# EAGLE design POE_PD_1_P-Schalter (EAGLE 6.5.0)
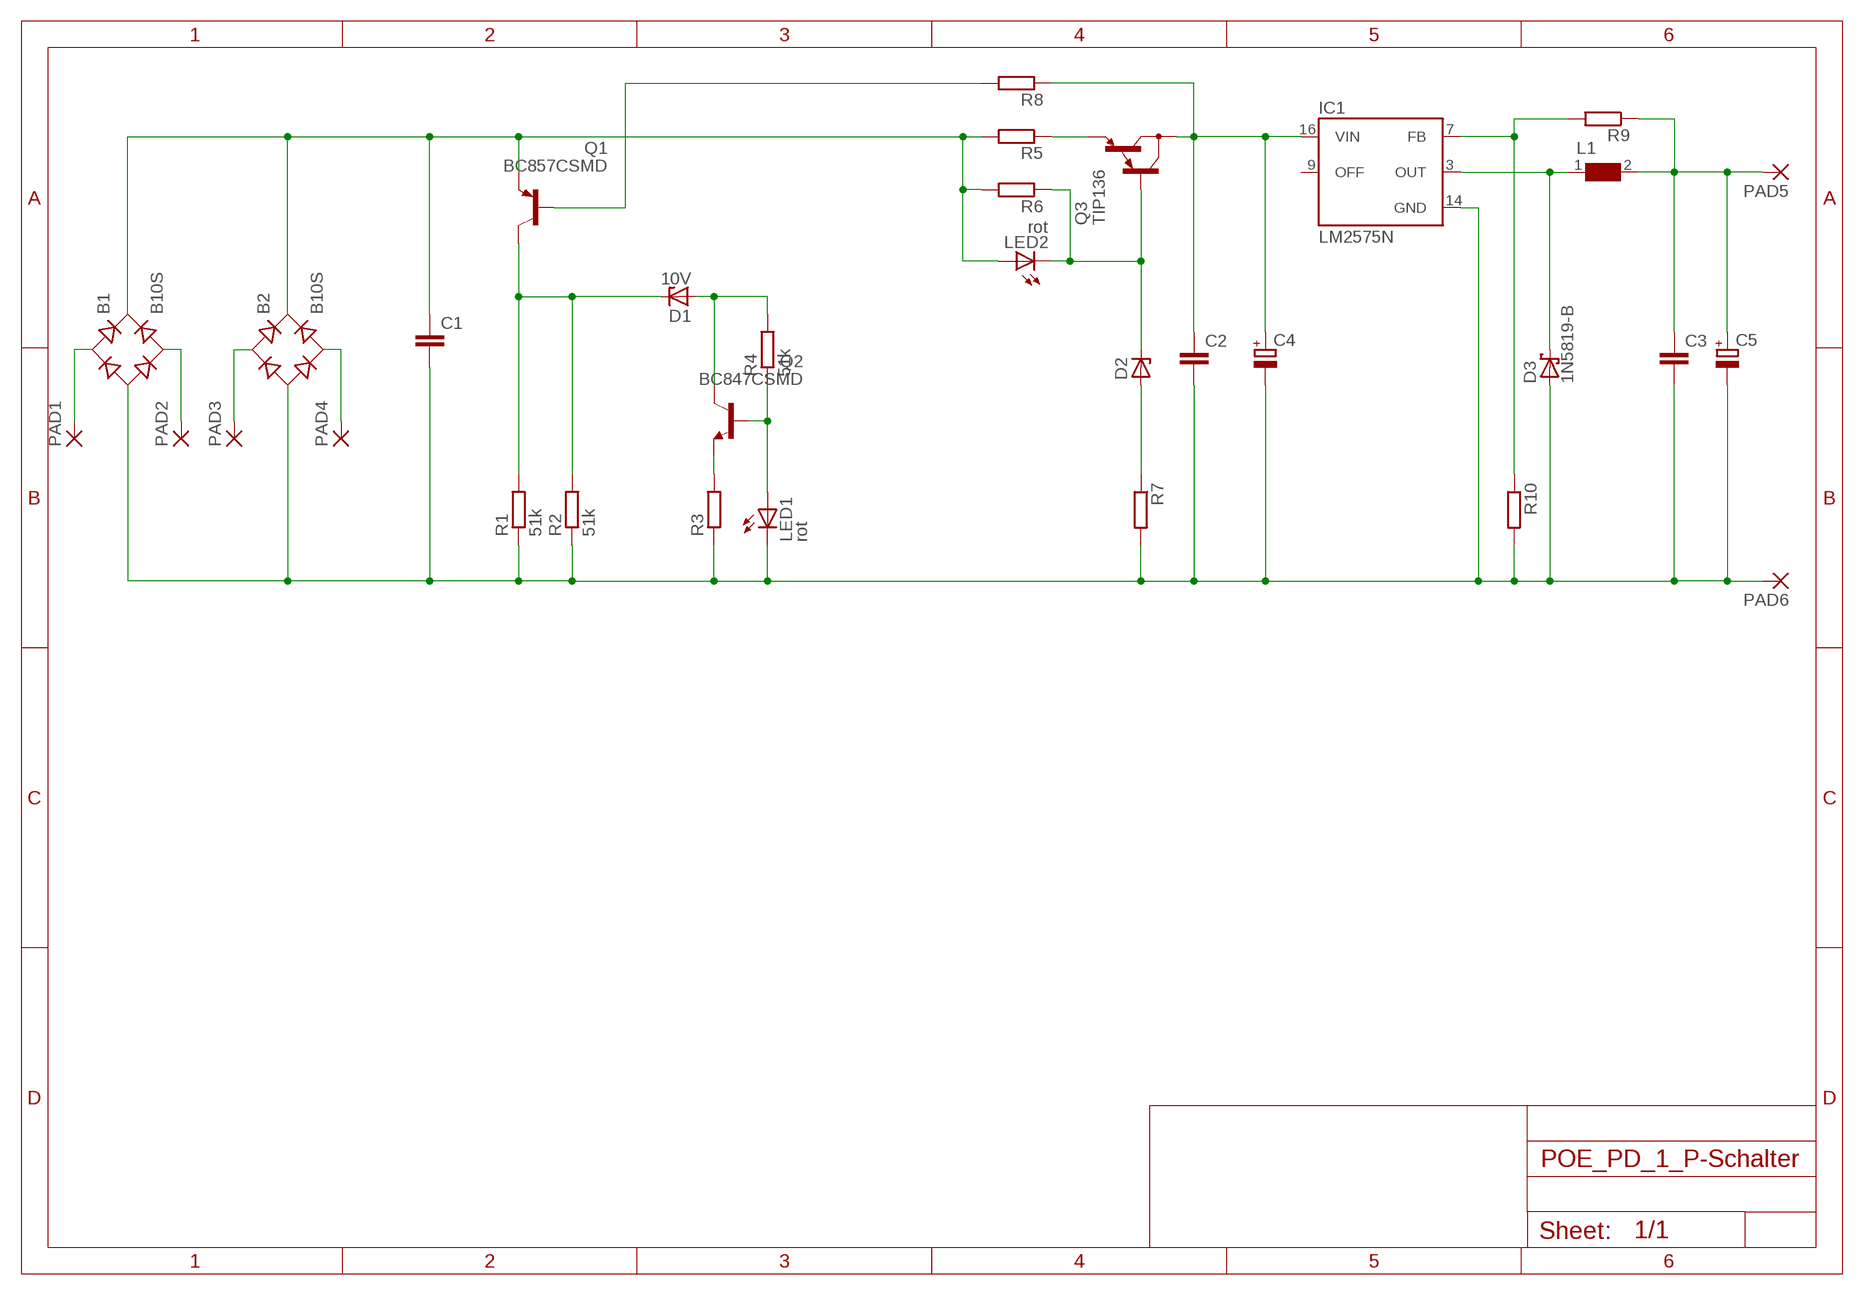
[diagram p0: schematic, sheet 1]

## Parts
B1  B10S  [MBS]
B2  B10S  [MBS]
C1  C-EUC0805  [C0805]
C2  C-EUC0805  [C0805]
C3  C-EUC0805  [C0805]
C4  CPOL-EU153CLV-0807  [153CLV-0807]
C5  CPOL-EU153CLV-0807  [153CLV-0807]
D1  10V  ZENER-DIODESOT23  [SOT23]
D2  ZENER-DIODESOT23  [SOT23]
D3  1N5819-B  [DO41-7.6]
IC1  LM2575N  [DIL16]
L1  WE-PD2_S  [WE-PD2_S]
LED1  rot  LEDCHIP-LED0805  [CHIP-LED0805]
LED2  rot  LEDCHIP-LED0805  [CHIP-LED0805]
PAD1  2,15/1,0  [2,15/1,0]
PAD2  2,15/1,0  [2,15/1,0]
PAD3  2,15/1,0  [2,15/1,0]
PAD4  2,15/1,0  [2,15/1,0]
PAD5  2,15/1,0  [2,15/1,0]
PAD6  2,15/1,0  [2,15/1,0]
Q1  BC857CSMD  [SOT23-BEC]
Q2  BC847CSMD  [SOT23]
Q3  TIP136  [TO220]
R1  51k  R-EU_R0603  [R0603]
R2  51k  R-EU_R0603  [R0603]
R3  R-EU_R0603  [R0603]
R4  51k  R-EU_R0603  [R0603]
R5  R-EU_R0603  [R0603]
R6  R-EU_R0603  [R0603]
R7  R-EU_R0603  [R0603]
R8  R-EU_R0603  [R0603]
R9  R-EU_R0603  [R0603]
R10  R-EU_R0603  [R0603]

## Nets
N$1: B1.- B2.- C1.2 C2.2 C3.2 C4.- C5.- D3.A IC1.14(GND) LED1.C PAD6.1(P) R1.1 R2.1 R3.1 R7.2 R10.2
N$2: B1.+ B2.+ C1.1 LED2.A Q1.E R5.2 R6.2
N$3: D1.3(C) Q1.C R1.2 R2.2
N$4: LED1.A Q2.1(B) R4.1
N$5: B1.AC1 PAD1.1(P)
N$6: Q2.2(E) R3.2
N$7: Q1.B R8.2
N$8: D1.1(A) Q2.3(C) R4.2
N$9: D2.1(A) R7.1
N$10: Q3.3(E) R5.1
N$11: D2.3(C) LED2.C Q3.1(B) R6.1
N$12: D3.C IC1.3(OUT) L1.1
N$13: C3.1 C5.+ L1.2 PAD5.1(P) R9.1
N$14: C2.1 C4.+ IC1.16(VIN) Q3.2(C) R8.1
N$15: IC1.7(FB) R9.2 R10.1
N$16: B1.AC2 PAD2.1(P)
N$17: B2.AC1 PAD3.1(P)
N$18: B2.AC2 PAD4.1(P)
Unconnected: IC1.9(OFF)

## Library data of the parts
B1 B2 = rectifier:B*S: Surface Mount Glass Passivated Bridge Rectifiers Source: Comchip Bridge Rectifiers B05S-G_B10S-G.pdf
C1-C3 = rcl:C-EU: CAPACITOR, European symbol
C4 C5 = rcl:CPOL-EU: POLARIZED CAPACITOR, European symbol
D1 D2 = diode:ZENER-DIODE: Z-Diode
D3 = diode:1N581*: 1.0A SCHOTTKY BARRIER RECTIFIER Source: http://www.diodes.com/datasheets/ds23001.pdf
IC1 = v-reg-3:LM2575: National Semiconductor <http://www.national.com> 1.0A "Simple Switcher"(c) 52kHz, Vout 1.23-37V (HV: 57V), Vin 40V (HV: 60V), 50µA standby current
L1 = wuerth_elektronik_EAGLE:WE-PD2: SMD-Power Inductors WE-PD2 Is recommended for the application with switching regulators from National Semiconductor, Linear Technology, Texas Instruments and Fairchild Semiconductor -- Switching regulators with low operating voltages (computer, laptop, mobile phones, pagers) -- Integrated DC/DC-converter
LED1 LED2 = led:LED: LED OSRAM: - CHIPLED LG R971, LG N971, LY N971, LG Q971, LY Q971, LO R971, LY R971 LH N974, LH R974 LS Q976, LO Q976, LY Q976 LO Q996 - Hyper CHIPLED LW Q18S LB Q993, LB Q99A, LB R99A - SideLED LS A670, LO A670, LY A670, LG A670, LP A670 LB A673, LV A673, LT A673, LW A673 LH A674 LY A675 LS A676, LA A676, LO A676, LY A676, LW A676 LS A679, LY A679, LG A679 - Hyper Micro SIDELED® LS Y876, LA Y876, LO Y876, LY Y876 LT Y87S - SmartLED LW L88C, LW L88S LB L89C, LB L89S, LG L890 LS L89K, LO L89K, LY L89K LS L896, LA L896, LO L896, LY L896 - TOPLED LS T670, LO T670, LY T670, LG T670, LP T670 LSG T670, LSP T670, LSY T670, LOP T670, LYG T670 LG T671, LOG T671, LSG T671 LB T673, LV T673, LT T673, LW T673 LH T674 LS T676, LA T676, LO T676, LY T676, LB T676, LH T676, LSB T676, LW T676 LB T67C, LV T67C, LT T67C, LS T67K, LO T67K, LY T67K, LW E67C LS E67B, LA E67B, LO E67B, LY E67B, LB E67C, LV E67C, LT E67C LW T67C LS T679, LY T679, LG T679 LS T770, LO T770, LY T770, LG T770, LP T770 LB T773, LV T773, LT T773, LW T773 LH T774 LS E675, LA E675, LY E675, LS T675 LS T776, LA T776, LO T776, LY T776, LB T776 LHGB T686 LT T68C, LB T68C - Hyper Mini TOPLED® LB M676 - Mini TOPLED Santana® LG M470 LS M47K, LO M47K, LY M47K Source: http://www.osram.convergy.de LUXEON: - LUMILED® LXK2-PW12-R00, LXK2-PW12-S00, LXK2-PW14-U00, LXK2-PW14-V00 LXK2-PM12-R00, LXK2-PM12-S00, LXK2-PM14-U00 LXK2-PE12-Q00, LXK2-PE12-R00, LXK2-PE12-S00, LXK2-PE14-T00, LXK2-PE14-U00 LXK2-PB12-K00, LXK2-PB12-L00, LXK2-PB12-M00, LXK2-PB14-N00, LXK2-PB14-P00, LXK2-PB14-Q00 LXK2-PR12-L00, LXK2-PR12-M00, LXK2-PR14-Q00, LXK2-PR14-R00 LXK2-PD12-Q00, LXK2-PD12-R00, LXK2-PD12-S00 LXK2-PH12-R00, LXK2-PH12-S00 LXK2-PL12-P00, LXK2-PL12-Q00, LXK2-PL12-R00 Source: www.luxeon.com KINGBRIGHT: KA-3528ASYC Source: www.kingbright.com
PAD1-PAD6 = wirepad:2,15/1,0: THROUGH-HOLE PAD
Q1 = transistor-pnp:BC857*: PNP Transistror
Q2 = transistor-npn:BC847*: NPN Transistor
Q3 = transistor-pnp:TIP136: PNP Darlington Transistor
R1-R10 = rcl:R-EU_: RESISTOR, European symbol

## Board
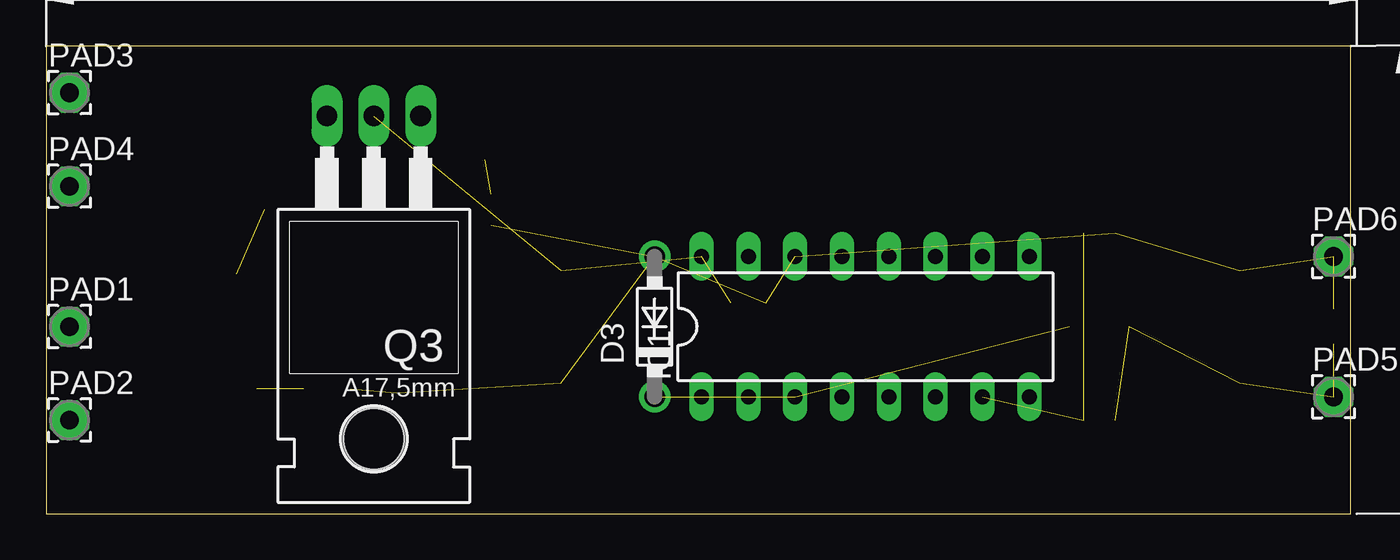
[diagram p1: board, top side]
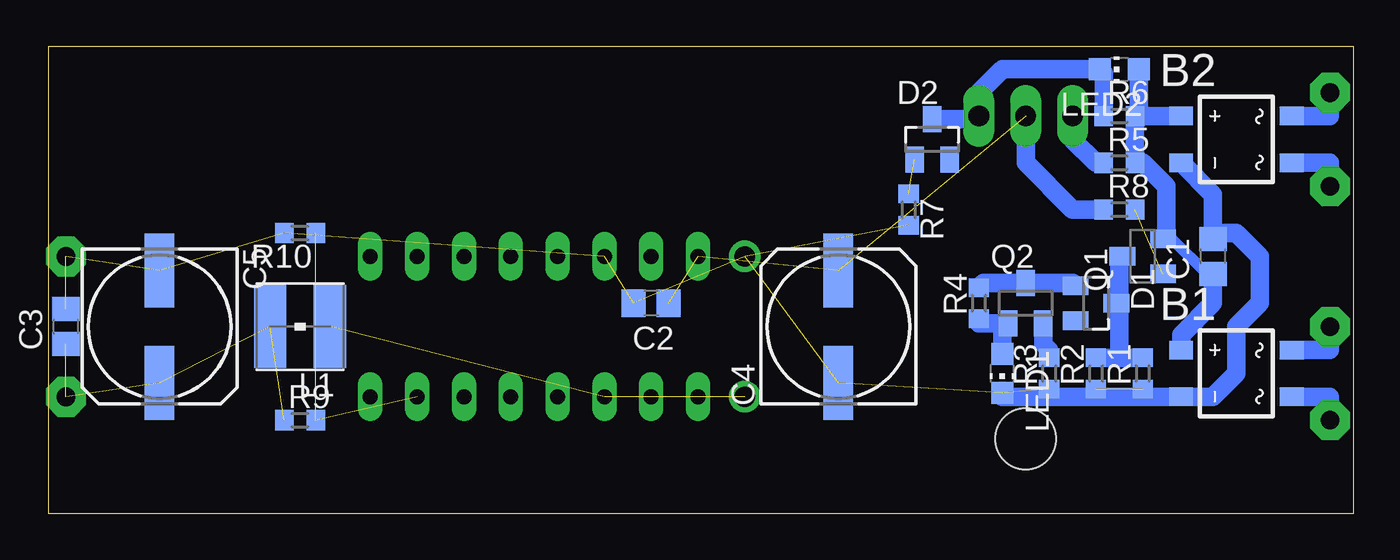
[diagram p2: board, bottom side, seen from below]

Size 70.79 x 25.39 mm. Coordinates in mm from the lower left corner, seen from the top.
Outline: 0,0 70.79,0 70.79,25.39 0,25.39 0,0
Copper layers (1*16): Top 0.035mm / dielectric 1.5mm / Bottom 0.035mm
Design rules "default": minimum track width 10mil, minimum drill 0.6mm, track to track 8mil, track to pad 8mil, pad to pad 8mil, via to via 8mil, smd to smd 8mil, copper to edge 40mil, drill to drill 8mil, minimum pad ring 10mil, minimum via ring 8mil, stop-mask expansion 4mil, vias tented up to drill 0mil, thermal gap 10mil

### Footprints (pad centres in the part's own frame; a part is rotated, then mirrored left to right if it is on the bottom)
MBS = smd 1 x 1.3: + -1.27,-3; - 1.27,-3; AC1 -1.27,3; AC2 1.27,3
C0805 = smd 1.3 x 1.5: 1 -0.95,0; 2 0.95,0
153CLV-0807 = smd 4 x 1.6: + 3.05,0; - -3.05,0
SOT23 = smd 1 x 1.4: 1 -0.95,-1.1; 2 0.95,-1.1; 3 0,1.1
DO41-7.6 = drill 1.1 pad 1.7: A 3.81,0; C -3.81,0
DIL16 = drill 0.813 long: 1 -8.89,-3.81; 2 -6.35,-3.81; 3 -3.81,-3.81; 4 -1.27,-3.81; 5 1.27,-3.81; 6 3.81,-3.81; 7 6.35,-3.81; 8 8.89,-3.81; 9 8.89,3.81; 10 6.35,3.81; 11 3.81,3.81; 12 1.27,3.81; 13 -1.27,3.81; 14 -3.81,3.81; 15 -6.35,3.81; 16 -8.89,3.81
WE-PD2_S = smd 1.75 x 4.5: 1 -1.625,0; 2 1.625,0
CHIP-LED0805 = smd 1.2 x 1.2: A 0,-1.05; C 0,1.05
2,15/1,0 = drill 1.016 pad 2.159 octagon: 1 0,0
SOT23-BEC = smd 1 x 1.4: B -0.95,-1.1; C 0,1.1; E 0.95,-1.1
TO220 = drill 1.118 long: 1 -2.54,-6.35; 2 0,-6.35; 3 2.54,-6.35 | hole 3.302: 0,11.176
R0603 = smd 1 x 1.1: 1 -0.85,0; 2 0.85,0

### Placement (x,y rotation side)
B1  6.35,7.62 270 bottom
B2  6.35,20.32 270 bottom
C1  7.62,13.97 90 bottom
C2  38.1,11.43 180 bottom
C3  69.85,10.16 90 bottom
C4  27.94,10.16 90 bottom
C5  64.77,10.16 270 bottom
D1  13.97,11.43 270 bottom
D2  22.86,20.32 0 bottom
D3  33.02,10.16 90 top
IC1  44.45,10.16 0 top
L1  57.15,10.16 180 bottom
LED1  19.05,7.62 180 bottom
LED2  12.7,24.13 90 bottom
PAD1  1.27,10.16 0 top
PAD2  1.27,5.08 0 top
PAD3  1.27,22.86 0 top
PAD4  1.27,17.78 0 top
PAD5  69.85,6.35 0 top
PAD6  69.85,13.97 0 top
Q1  11.43,13.97 90 bottom
Q2  17.78,11.43 0 bottom
Q3  17.78,15.24 180 top
R1  11.43,7.62 90 bottom
R2  13.97,7.62 90 bottom
R3  16.51,7.62 90 bottom
R4  20.32,11.43 90 bottom
R5  12.7,19.05 0 bottom
R6  12.7,21.59 0 bottom
R7  24.13,16.51 270 bottom
R8  12.7,16.51 0 bottom
R9  57.15,5.08 0 bottom
R10  57.15,15.24 180 bottom

### Tracks (layer width: path | path; a pad name or v marks a point on that pad's centre or on a via)
N$1  (11 unrouted)
  Bottom 1.016: 11.43,6.35 B1.- 7.62,6.35 6.35,7.62 6.35,10.16 5.08,11.43 5.08,13.97 6.35,15.24 7.62,15.24 C1.2 7.62,17.32 B2.- | R1.1 11.43,6.35 | 11.43,6.35 19.05,6.35 LED1.C
N$2
  Bottom 0.61: Q1.E 9.84,14.92 7.94,13.02 C1.1
  Bottom 1.016: B1.+ 9.35,9.7 7.62,11.43 C1.1 | B2.+ R6.2 | R6.2 R5.2 11.43,19.05 10.16,17.78 10.16,15.09 Q1.E | LED2.A 11.65,21.79 R6.2
N$3
  Bottom 1.016: R1.2 12.7,8.47 | 12.7,8.47 R2.2 | 12.7,11.43 12.7,8.47 | Q1.C 12.7,13.97 12.7,11.43 | 12.7,11.43 D1.3
N$4
  Bottom 1.016: R4.1 20.32,10.33 Q2.1 18.73,10.16 19.05,10.16 LED1.A
N$5
  Bottom 1.016: B1.AC1 1.27,8.89 PAD1.1
N$6
  Bottom 1.016: Q2.2 16.83,9.21 16.51,8.89 R3.2
N$7  (1 unrouted)
N$8
  Bottom 1.016: D1.1 15.22,12.53 Q2.3 20.07,12.53 R4.2
N$9  (1 unrouted)
N$10
  Bottom 1.016: R5.1 13.97,19.05 15.24,20.32 Q3.3
N$11
  Bottom 1.016: R6.1 13.55,23.93 LED2.C 19.05,24.13 20.32,22.86 Q3.1 20.49,21.42 D2.3
N$12  (2 unrouted)
N$13  (4 unrouted)
N$14  (3 unrouted)
  Bottom 1.016: R8.1 15.24,16.51 17.78,19.05 Q3.2
N$15  (2 unrouted)
N$16
  Bottom 1.016: B1.AC2 1.27,6.35 PAD2.1
N$17
  Bottom 1.016: B2.AC1 1.27,21.59 PAD3.1
N$18
  Bottom 1.016: B2.AC2 1.27,19.05 PAD4.1